# Altium schematic sheet Sheet1.SchDoc: Smart IoT Wallswitch CORE module
size A4; DrawnBy: Bc. Miroslav Kažimír; DocumentNumber: MCU, buttons and GPIOs; SheetNumber: 2; SheetTotal: 3
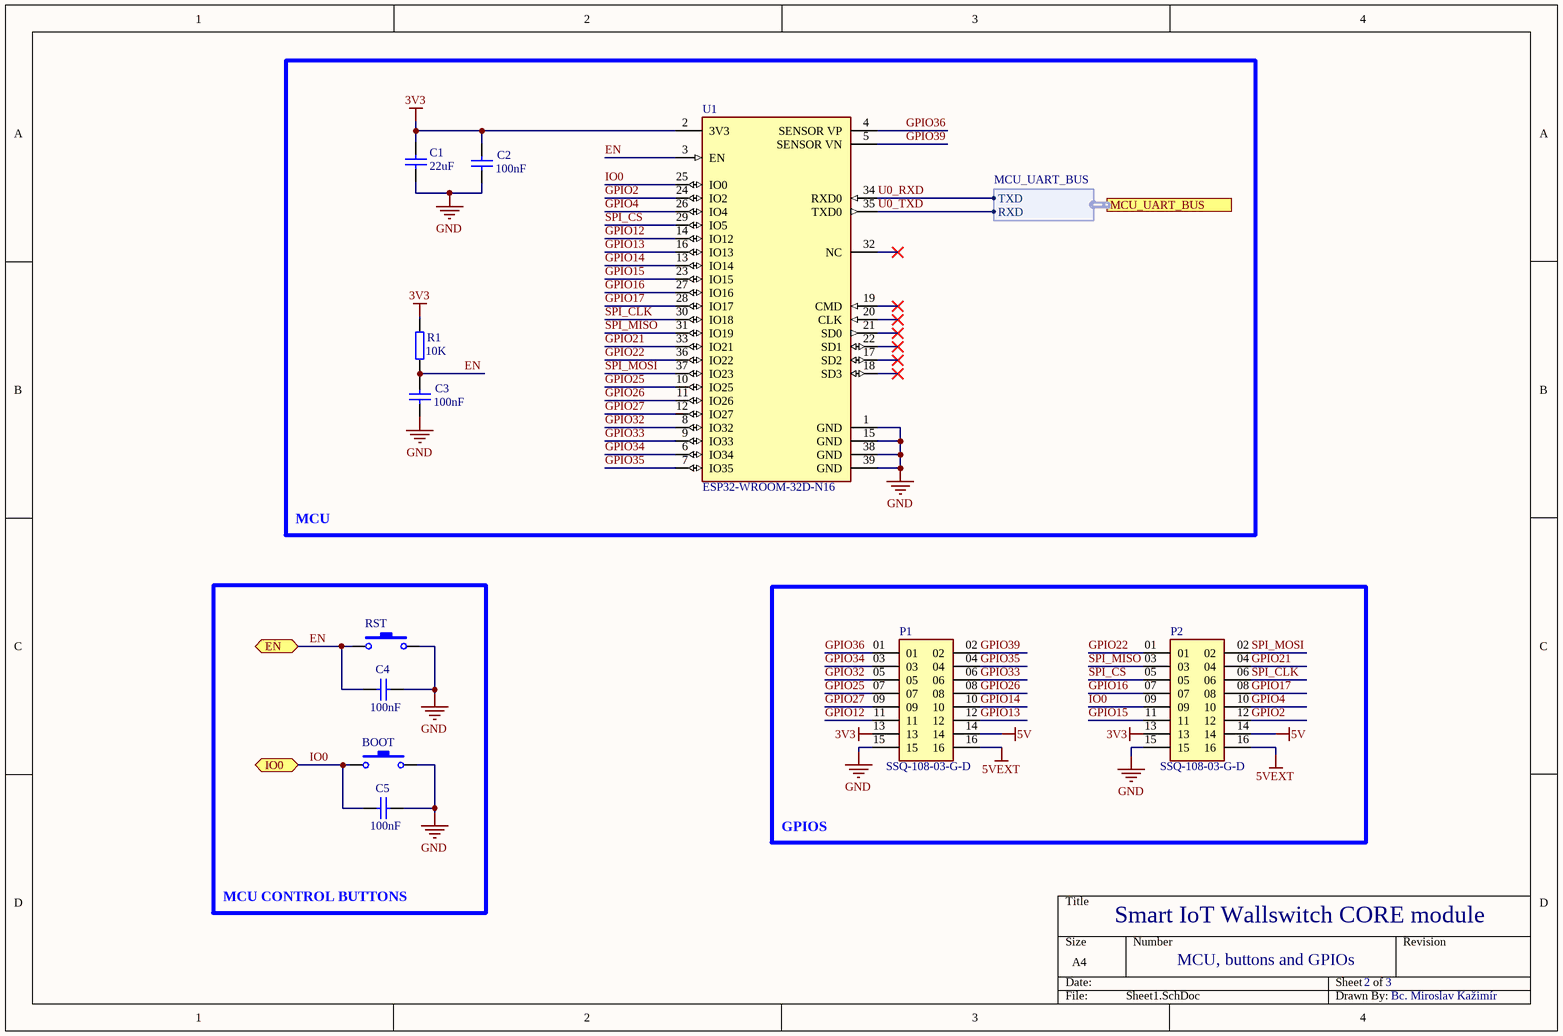
[diagram p0: Sheet1.SchDoc]

## Parts
BOOT  SKRKAHE020  [SKRKAEE020]  (value not drawn)
C1  Capacitance: 22uF  [FP-GRM21B-0_15-IPC_A]  (hidden comment: GRM21BR61A226ME51L)
C2  Capacitance: 100nF  [FP-C0805C-DN-IPC_A]  (hidden comment: C0805C104K5RAC7411)
C3  Capacitance: 100nF  [FP-C0805C-DN-IPC_A]  (hidden comment: C0805C104K5RAC7411)
C4  Capacitance: 100nF  [FP-C0805C-DN-IPC_A]  (hidden comment: C0805C104K5RAC7411)
C5  Capacitance: 100nF  [FP-C0805C-DN-IPC_A]  (hidden comment: C0805C104K5RAC7411)
P1  SSQ-108-03-G-D  [SAMTEC_SSQ-108-XX-X-D]
P2  SSQ-108-03-G-D  [SAMTEC_SSQ-108-XX-X-D]
R1  Resistance: 10K  [RESC2012X70N]  (hidden comment: ERJ-UP6J103V)
RST  SKRKAHE020  [SKRKAEE020]  (value not drawn)
U1  ESP32-WROOM-32D-N16  [FP-ESP32-WROOM-32D_16MB-MFG]

## Blocks framed on the sheet
MCU: C1-C3 R1 U1
MCU CONTROL BUTTONS: BOOT C4 C5 RST
GPIOS: P1 P2

## Ports
EN (bidir), IO0 (bidir), MCU_UART_BUS (harness MCU_UART_BUS)

## Harnesses
MCU_UART_BUS: TXD, RXD

## Nets
3V3: C1.1 C2.1 P1.13 P2.13 R1.1 U1.2(3V3)
5V: P1.14 P2.14
5VEXT: P1.16 P2.16
GND: BOOT.2 C1.2 C2.2 C3.2 C4.2 C5.2 P1.15 P2.15 RST.2 U1.1(GND) U1.15(GND) U1.38(GND) U1.39(GND)
EN: C3.1 C4.1 R1.2 RST.1 U1.3(EN) ; port EN
GPIO2: P2.12 U1.24(IO2)
GPIO4: P2.10 U1.26(IO4)
GPIO12: P1.11 U1.14(IO12)
GPIO13: P1.12 U1.16(IO13)
GPIO14: P1.10 U1.13(IO14)
GPIO15: P2.11 U1.23(IO15)
GPIO16: P2.07 U1.27(IO16)
GPIO17: P2.08 U1.28(IO17)
GPIO21: P2.04 U1.33(IO21)
GPIO22: P2.01 U1.36(IO22)
GPIO25: P1.07 U1.10(IO25)
GPIO26: P1.08 U1.11(IO26)
GPIO27: P1.09 U1.12(IO27)
GPIO32: P1.05 U1.8(IO32)
GPIO33: P1.06 U1.9(IO33)
GPIO34: P1.03 U1.6(IO34)
GPIO35: P1.04 U1.7(IO35)
GPIO36: P1.01 U1.4(SENSOR_VP)
GPIO39: P1.02 U1.5(SENSOR_VN)
IO0: BOOT.1 C5.1 P2.09 U1.25(IO0) ; port IO0
SPI_CLK: P2.06 U1.30(IO18)
SPI_CS: P2.05 U1.29(IO5)
SPI_MISO: P2.03 U1.31(IO19)
SPI_MOSI: P2.02 U1.37(IO23)
U0_RXD: U1.34(RXD0) ; port MCU_UART_BUS.TXD
U0_TXD: U1.35(TXD0) ; port MCU_UART_BUS.RXD

Not connected (* = marked no-connect by the designer): U1 17(SD2)* 18(SD3)* 19(CMD)* 20(CLK)* 21(SD0)* 22(SD1)* 32(NC)*

## Library data of the parts
BOOT RST = SKRKAHE020: Switch Tactile N.O. SPST Round Button Gull Wing 0.05A 12VDC 0.98N SMD T/R; Manufacturer: Alps Electric; Supplier 1: Mouser; Manufacturer Part Number: SKRKAHE020; RoHS: Yes; Category: Tactile Switches; Stock 1: 28067; Pricing 1: 1=0,76000, 10=0,67100, 50=0,60600, 100=0,57700, 1000=0,46700, 10000=0,45000 (USD); RoHS Compliant: Yes; Supplier Part Number 1: 688-SKRKAHE010
C1 = GRM21BR61A226ME51L: 贴片电容（MLCC） 22µF ±20% 10V X5R 0805; Manufacturer: Murata; Supplier 1: Mouser; Manufacturer Part Number: GRM21BR61A226ME51L; RoHS: Yes; Category: Ceramic Capacitors; Stock 1: 1508057; Pricing 1: 1=0,28000, 10=0,19200, 50=0,19200, 100=0,10900, 500=0,07700, 1000=0,06800, 3000=0,06300, 6000=0,05900, 10000=0,05900 (USD); Mount: Surface Mount; Case/Package: 0805; Case Code (Metric): 2012; Case Code (Imperial): 0805; Weight: 0.000335oz; Min Operating Temperature: -55°C; Max Operating Temperature: 85°C; Tolerance: 20%; Dielectric: X5R; Packaging: Tape and Reel; Voltage Rating: 10V; Termination: SMD/SMT; Voltage Rating (DC): 10V; Package Quantity: 3000; Length: 2mm; Width: 0.049inch; Height: 1.25mm; Thickness: 0.055inch; Depth: 1.25mm; Radiation Hardening: No; REACH SVHC: No SVHC; Lead Free: Lead Free; RoHS Compliant: Yes; ComponentLink1URL: http://www.farnell.com/datasheets/1955716.pdf?src-supplier=Farnell; ComponentLink1Description: http://www.farnell.com/datasheets/1955716.pdf?src-supplier=Farnell; ComponentLink2URL: http://www.mouser.com/ds/2/281/c02e-2905.pdf?src-supplier=Mouser; ComponentLink2Description: http://www.mouser.com/ds/2/281/c02e-2905.pdf?src-supplier=Mouser; ComponentLink3URL: http://www.farnell.com/datasheets/1955716.pdf?src-supplier=Newark; ComponentLink3Description: http://www.farnell.com/datasheets/1955716.pdf?src-supplier=Newark; ComponentLink4URL: http://www.farnell.com/datasheets/1955716.pdf?src-supplier=Element14; ComponentLink4Description: http://www.farnell.com/datasheets/1955716.pdf?src-supplier=Element14; ComponentLink5URL: http://search.murata.co.jp/Ceramy/image/img/A01X/G101/ENG/GRM21BR61A226ME51-01.pdf?src-supplier=Digi-Key; ComponentLink5Description: http://search.murata.co.jp/Ceramy/image/img/A01X/G101/ENG/GRM21BR61A226ME51-01.pdf?src-supplier=Digi-Key; ComponentLink6URL: http://psearch.en.murata.com/capacitor/product/GRM21BR61A226ME51%23.html?src-supplier=Avnet; ComponentLink6Description: http://psearch.en.murata.com/capacitor/product/GRM21BR61A226ME51%23.html?src-supplier=Avnet; Supplier Part Number 1: 81-GRM21BR61A226ME1L
C2-C5 = C0805C104K5RAC7411: Cap Ceramic 0.1uF 50V X7R 10% SMD 0805 125°C Paper T/R; Manufacturer: KEMET; Supplier 1: Mouser; Manufacturer Part Number: C0805C104K5RAC7411; RoHS: Yes; Category: Ceramic Capacitors; Stock 1: 1484324; Pricing 1: 1=0,13000, 10=0,09300, 50=0,09300, 100=0,04400, 500=0,03100, 1000=0,02600, 2500=0,02400, 5000=0,02200, 10000=0,02100, 15000=0,02000 (USD); Mount: Surface Mount; Case/Package: 0805; Dielectric Material: Ceramic; Min Operating Temperature: -55°C; Max Operating Temperature: 125°C; Packaging: Tape and Reel; Tolerance: 10%; Dielectric: X7R; Voltage Rating (DC): 50V; Construction: Flat; Length: 2mm; Height: 0.9mm; Depth: 1.25mm; Radiation Hardening: No; RoHS Compliant: Yes; ComponentLink1URL: http://components.arrow.com/part/dataview/30748302S8994022N7429?src-supplier=Arrow+Electronics; ComponentLink1Description: http://components.arrow.com/part/dataview/30748302S8994022N7429?src-supplier=Arrow+Electronics; ComponentLink2URL: https://www.verical.com/server-webapp/html/getDatasheet?partID=248513&src-supplier=Verical; ComponentLink2Description: https://www.verical.com/server-webapp/html/getDatasheet?partID=248513&src-supplier=Verical; Supplier Part Number 1: 80-C0805C104K5RACLR
P1 P2 = SSQ-108-03-G-D: Headers & Wire Housings Tiger Buy Socket Strip with Square Tails, 0.100 Pitch; Manufacturer: Samtec; Number of Contacts: 16; Gender: Female; Connector Type: Receptacle; Max Current Rating: 7.6A; Contact Resistance: 10mR; Max Voltage Rating (AC): 550V; Pitch: 2.54mm; Row Spacing: 0.1inch; Supplier 1: Mouser; Manufacturer Part Number: SSQ-108-03-G-D; RoHS: Yes; Category: Headers and Wire Housings; Stock 1: 211; Pricing 1: 1=4,53000, 10=4,34000, 50=4,34000, 100=3,62000, 500=3,07000, 1000=2,62000, 2500=2,40000, 5000=2,35000, 10000=2,29000 (USD); Mount: Through Hole; Contact Plating: Gold; Contact Material: Bronze; Color: Black; Housing Color: Black; Housing Material: Polymer; Min Operating Temperature: -55°C; Max Operating Temperature: 125°C; Number of Rows: 2; Termination: Solder; Packaging: Bulk; Number of Positions: 16; Orientation: Straight; Series: SSQ; Contact Type: Female Socket; Length: 20.83mm; Width: 4.95mm; Depth: 4.95mm; Lead Free: Lead Free; RoHS Compliant: Yes; ComponentLink1URL: https://datasheet.ciiva.com/749/ssq-1xx-xx-xxx-x-xx-xxx-xx-x-mkt-749229.pdf?src-supplier=Digi-Key; ComponentLink1Description: https://datasheet.ciiva.com/749/ssq-1xx-xx-xxx-x-xx-xxx-xx-x-mkt-749229.pdf?src-supplier=Digi-Key; Supplier Part Number 1: 200-SSQ10803GD
R1 = ERJ-UP6J103V: Res 10K Ohm 5% 1/2W 0805; Manufacturer: Panasonic; Supplier 1: Mouser; Manufacturer Part Number: ERJ-UP6J103V; RoHS: No; Category: Chip SMD Resistors; Stock 1: 46150; Pricing 1: 1=0,16000, 10=0,11900, 50=0,11900, 100=0,05800, 1000=0,02500, 10000=0,02100 (USD); Supplier Part Number 1: 667-ERJ-UP6J103V
U1 = ESP32-WROOM-32D-N16: Bluetooth and Wi-Fi Module / 2.4GHz to 2.5GHz 2.7V to 3.6V 16MB Flash / 38-Pin SMD Module; Manufacturer: Espressif Systems; Supplier 1: Mouser; Manufacturer Part Number: ESP32-WROOM-32D-N16; RoHS: No; Category: Uncategorized; Stock 1: 6841; Pricing 1: 1=4,65000, 10=4,65000, 50=4,65000, 100=4,65000, 1000=4,65000, 10000=4,65000 (USD); Supplier Part Number 1: 356-ES32WROOM32D16MB